# EAGLE design xmod_A (EAGLE 8.1.0)
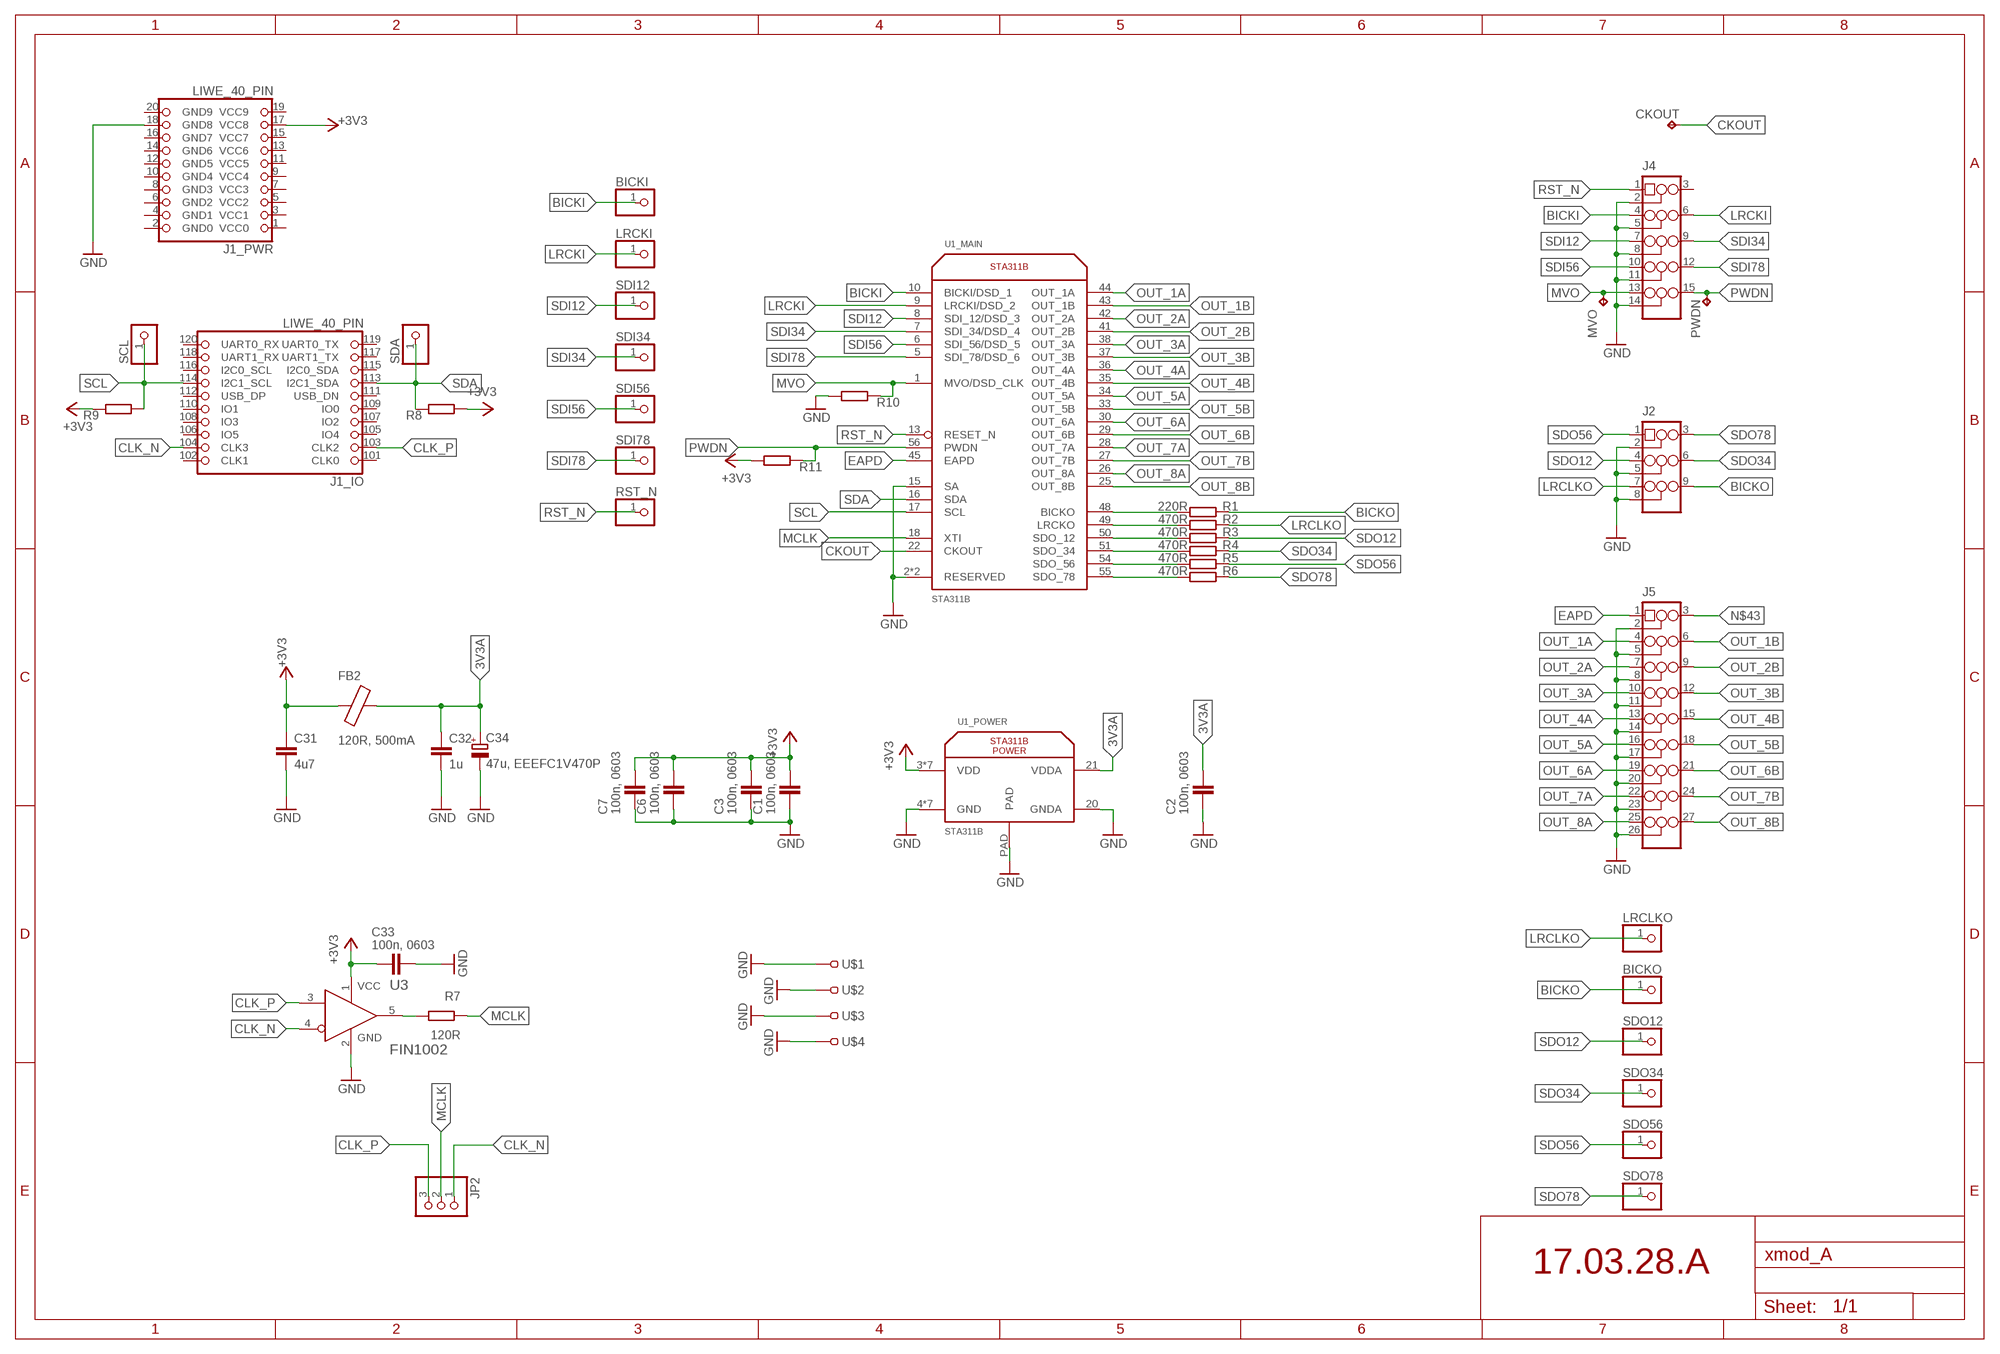
[diagram p0: schematic, sheet 1]

## Parts
BICKI  PINHD-1X1  [1X01]
BICKO  PINHD-1X1  [1X01]
C1  100n, 0603  C-EUC0603  [C0603]
C2  100n, 0603  C-EUC0603  [C0603]
C3  100n, 0603  C-EUC0603  [C0603]
C6  100n, 0603  C-EUC0603  [C0603]
C7  100n, 0603  C-EUC0603  [C0603]
C31  4u7  C-EUC0603K  [C0603K]
C32  1u  C-EUC0603K  [C0603K]
C33  100n, 0603  C-EUC0603  [C0603]
C34  47u, EEEFC1V470P  C-POL_E  [EEE-FC1V470P]
CKOUT  TPTP14R  [TP14R]
FB2  120R, 500mA  FB_0603  [L0603]
J1  LIWE_40_PIN  [LIWE_40_PIN_8X8]
J2  PINHD-3X3/90  [3X03/90]
J4  PINHD-3X5/90  [3X05/90]
J5  PINHD-3X9/90  [3X9/90]
JP2  PINHD-1X3  [1X03]
LRCKI  PINHD-1X1  [1X01]
LRCLKO  PINHD-1X1  [1X01]
MVO  TPTP14R  [TP14R]
PWDN  TPTP14R  [TP14R]
R1  220R  R-EU_R0603  [R0603]
R2  470R  R-EU_R0603  [R0603]
R3  470R  R-EU_R0603  [R0603]
R4  470R  R-EU_R0603  [R0603]
R5  470R  R-EU_R0603  [R0603]
R6  470R  R-EU_R0603  [R0603]
R7  120R  R-EU_R0603  [R0603]
R8  R-EU_R0603  [R0603]
R9  R-EU_R0603  [R0603]
R10  R-EU_R0603  [R0603]
R11  R-EU_R0603  [R0603]
RST_N  PINHD-1X1  [1X01]
SCL  PINHD-1X1  [1X01]
SDA  PINHD-1X1  [1X01]
SDI12  PINHD-1X1  [1X01]
SDI34  PINHD-1X1  [1X01]
SDI56  PINHD-1X1  [1X01]
SDI78  PINHD-1X1  [1X01]
SDO12  PINHD-1X1  [1X01]
SDO34  PINHD-1X1  [1X01]
SDO56  PINHD-1X1  [1X01]
SDO78  PINHD-1X1  [1X01]
U1  STA311B  [VFQFPN_56_8X8]
U3  FIN1002  [SOT95P280X140-5N]
U$1  TEST-22-MULTICOMP  [TEST_1MM]
U$2  TEST-22-MULTICOMP  [TEST_1MM]
U$3  TEST-22-MULTICOMP  [TEST_1MM]
U$4  TEST-22-MULTICOMP  [TEST_1MM]

## Nets
3V3A: C2.1 C32.1 C34.1(+) FB2.1 U1.21(_POWER:VDDA)
+3V3: C1.1 C3.1 C6.1 C7.1 C31.1 C33.2 FB2.2 J1.17(_PWR:VCC8) R8.1 R9.2 R11.2 U1.3(_POWER:VDD) U1.11(_POWER:VDD) U1.24(_POWER:VDD) U1.31(_POWER:VDD) U1.39(_POWER:VDD) U1.46(_POWER:VDD) U1.52(_POWER:VDD) U3.1(VCC)
BICKI: BICKI.1 J4.4 U1.10(_MAIN:BICKI/DSD_1)
BICKO: BICKO.1 J2.9 R1.2
CKOUT: CKOUT.TP U1.22(_MAIN:CKOUT)
CLK_N: J1.104(_IO:CLK3) JP2.1 U3.4(RIN-)
CLK_P: J1.103(_IO:CLK2) JP2.3 U3.3(RIN+)
EAPD: J5.1 U1.45(_MAIN:EAPD)
GND: C1.2 C2.2 C3.2 C6.2 C7.2 C31.2 C32.2 C33.1 C34.2(-) J1.18(_PWR:GND8) J2.2 J2.5 J2.8 J4.2 J4.5 J4.8 J4.11 J4.14 J5.2 J5.5 J5.8 J5.11 J5.14 J5.17 J5.20 J5.23 J5.26 R10.2 U1.2(_MAIN:RESERVED) U1.4(_POWER:GND) U1.12(_POWER:GND) U1.14(_MAIN:RESERVED) U1.15(_MAIN:SA) U1.20(_POWER:GNDA) U1.23(_POWER:GND) U1.32(_POWER:GND) U1.40(_POWER:GND) U1.47(_POWER:GND) U1.53(_POWER:GND) U1.PAD(_POWER:PAD) U3.2(GND) U$1.1 U$2.1 U$3.1 U$4.1
LRCKI: J4.6 LRCKI.1 U1.9(_MAIN:LRCKI/DSD_2)
LRCLKO: J2.7 LRCLKO.1 R2.2
MCLK: JP2.2 R7.1 U1.18(_MAIN:XTI)
MVO: J4.13 MVO.TP R10.1 U1.1(_MAIN:MVO/DSD_CLK)
N$1: R1.1 U1.48(_MAIN:BICKO)
N$2: R2.1 U1.49(_MAIN:LRCKO)
N$3: R3.1 U1.50(_MAIN:SDO_12)
N$4: R4.1 U1.51(_MAIN:SDO_34)
N$5: R5.1 U1.54(_MAIN:SDO_56)
N$6: R6.1 U1.55(_MAIN:SDO_78)
N$7: R7.2 U3.5(ROUT)
N$43: J5.3
OUT_1A: J5.4 U1.44(_MAIN:OUT_1A)
OUT_1B: J5.6 U1.43(_MAIN:OUT_1B)
OUT_2A: J5.7 U1.42(_MAIN:OUT_2A)
OUT_2B: J5.9 U1.41(_MAIN:OUT_2B)
OUT_3A: J5.10 U1.38(_MAIN:OUT_3A)
OUT_3B: J5.12 U1.37(_MAIN:OUT_3B)
OUT_4A: J5.13 U1.36(_MAIN:OUT_4A)
OUT_4B: J5.15 U1.35(_MAIN:OUT_4B)
OUT_5A: J5.16 U1.34(_MAIN:OUT_5A)
OUT_5B: J5.18 U1.33(_MAIN:OUT_5B)
OUT_6A: J5.19 U1.30(_MAIN:OUT_6A)
OUT_6B: J5.21 U1.29(_MAIN:OUT_6B)
OUT_7A: J5.22 U1.28(_MAIN:OUT_7A)
OUT_7B: J5.24 U1.27(_MAIN:OUT_7B)
OUT_8A: J5.25 U1.26(_MAIN:OUT_8A)
OUT_8B: J5.27 U1.25(_MAIN:OUT_8B)
PWDN: J4.15 PWDN.TP R11.1 U1.56(_MAIN:PWDN)
RST_N: J4.1 RST_N.1 U1.13(_MAIN:RESET_N)
SCL: J1.114(_IO:I2C1_SCL) R9.1 SCL.1 U1.17(_MAIN:SCL)
SDA: J1.113(_IO:I2C1_SDA) R8.2 SDA.1 U1.16(_MAIN:SDA)
SDI12: J4.7 SDI12.1 U1.8(_MAIN:SDI_12/DSD_3)
SDI34: J4.9 SDI34.1 U1.7(_MAIN:SDI_34/DSD_4)
SDI56: J4.10 SDI56.1 U1.6(_MAIN:SDI_56/DSD_5)
SDI78: J4.12 SDI78.1 U1.5(_MAIN:SDI_78/DSD_6)
SDO12: J2.4 R3.2 SDO12.1
SDO34: J2.6 R4.2 SDO34.1
SDO56: J2.1 R5.2 SDO56.1
SDO78: J2.3 R6.2 SDO78.1
Unconnected: J1.1(_PWR:VCC0) J1.2(_PWR:GND0) J1.3(_PWR:VCC1) J1.4(_PWR:GND1) J1.5(_PWR:VCC2) J1.6(_PWR:GND2) J1.7(_PWR:VCC3) J1.8(_PWR:GND3) J1.9(_PWR:VCC4) J1.10(_PWR:GND4) J1.11(_PWR:VCC5) J1.12(_PWR:GND5) J1.13(_PWR:VCC6) J1.14(_PWR:GND6) J1.15(_PWR:VCC7) J1.16(_PWR:GND7) J1.19(_PWR:VCC9) J1.20(_PWR:GND9) J1.101(_IO:CLK0) J1.102(_IO:CLK1) J1.105(_IO:IO4) J1.106(_IO:IO5) J1.107(_IO:IO2) J1.108(_IO:IO3) J1.109(_IO:IO0) J1.110(_IO:IO1) J1.111(_IO:USB_DN) J1.112(_IO:USB_DP) J1.115(_IO:I2C0_SDA) J1.116(_IO:I2C0_SCL) J1.117(_IO:UART1_TX) J1.118(_IO:UART1_RX) J1.119(_IO:UART0_TX) J1.120(_IO:UART0_RX) J4.3

## Notes on the sheet
- 17.03.28.A

## Library data of the parts
BICKI BICKO LRCKI LRCLKO RST_N SCL SDA SDI12 SDI34 SDI56 SDI78 SDO12 SDO34 SDO56 SDO78 = 25pinhead:PINHD-1X1: PIN HEADER
C1-C3 C6 C7 C31-C33 = rcl:C-EU: CAPACITOR, European symbol
C34 = 25cmsquare:C-POL: Panasonic Alluminium Electrolytic Capacitors / FC Series: FC Type: V http://www.farnell.com/datasheets/2059994.pdf?_ga=1.187970088.1293831445.1473845555
CKOUT MVO PWDN = testpad:TP: Test pad
FB2 = 25cmsquare:FB
J1 = 25cmsquare:LIWE_40_PIN
J2 = 25pinhead:PINHD-3X3
J4 = 25pinhead:PINHD-3X5
J5 = 25pinhead:PINHD-3X9
JP2 = 25pinhead:PINHD-1X3: PIN HEADER
R1-R11 = rcl:R-EU_: RESISTOR, European symbol
U1 = 25cmsquare:STA311B
U3 = 25cmsquare:FIN1002
U$1-U$4 = 25cmsquare:TEST-22-MULTICOMP: MULTICOMP TEST-22 TEST PIN, PCB, 1.0MM FARNELL: 1702010

## Board
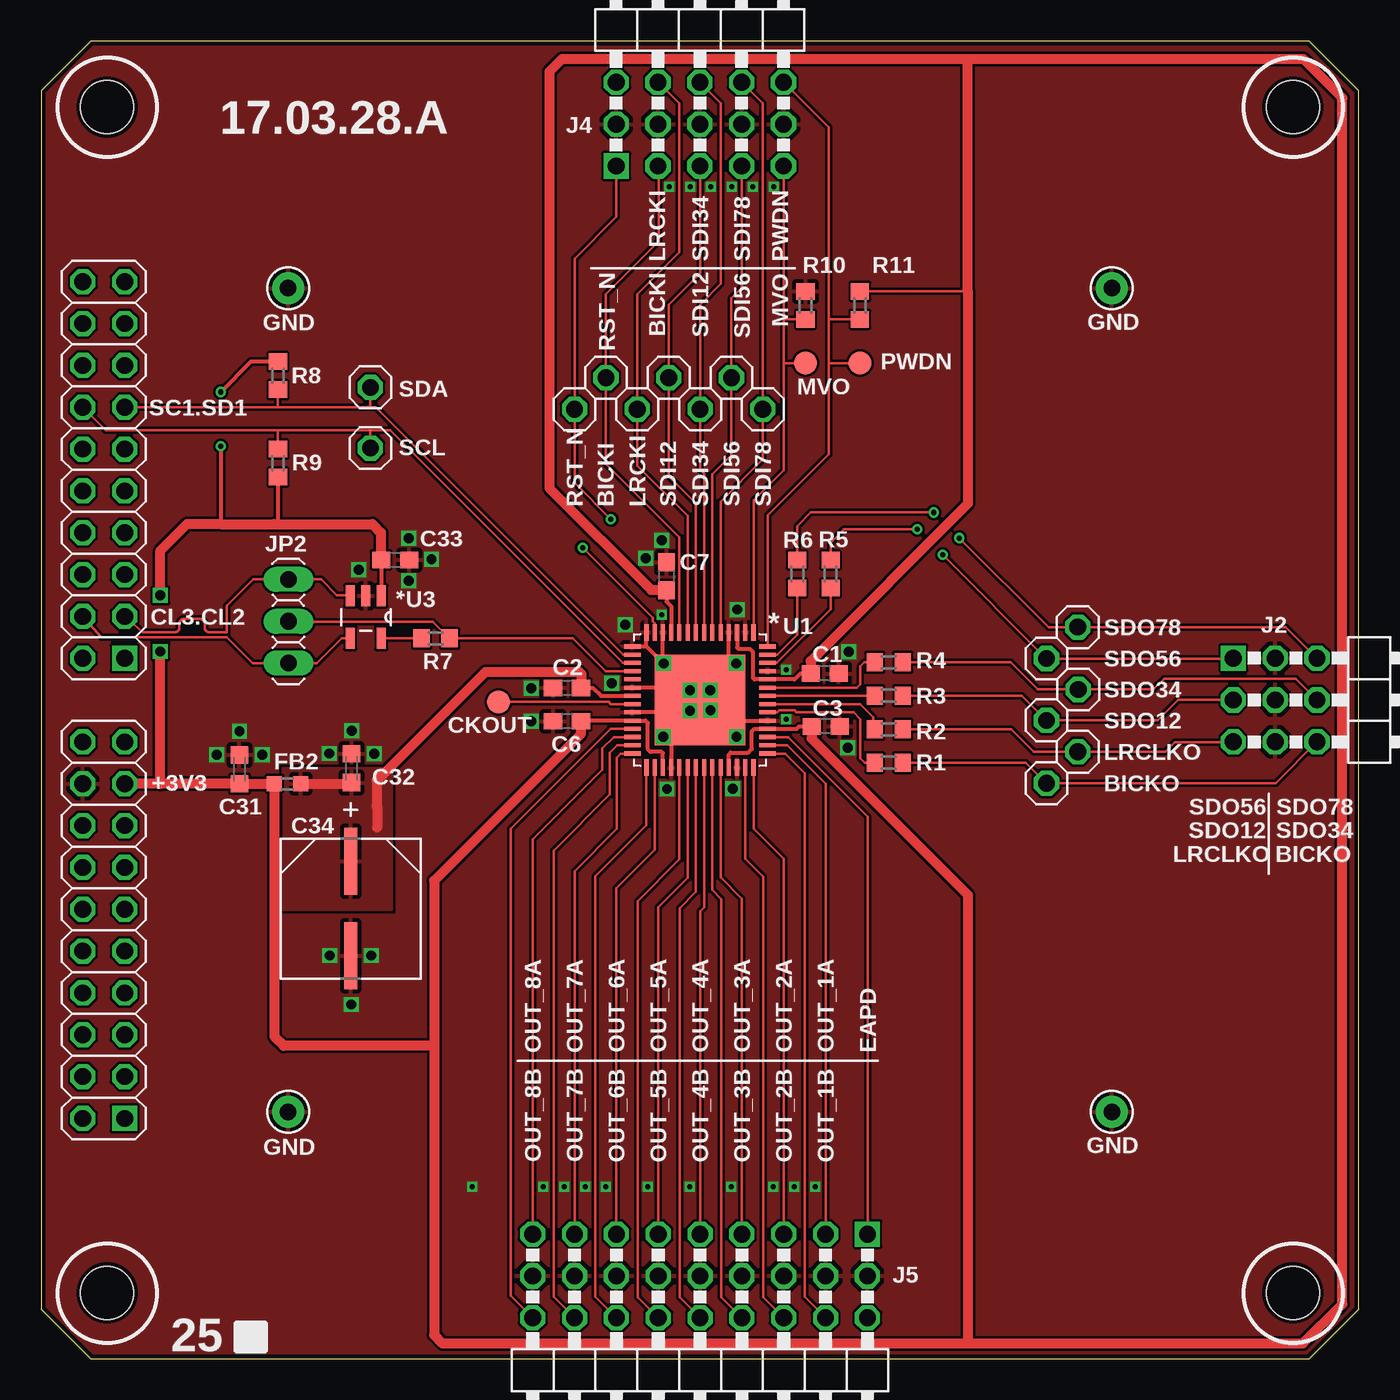
[diagram p1: board, top side]
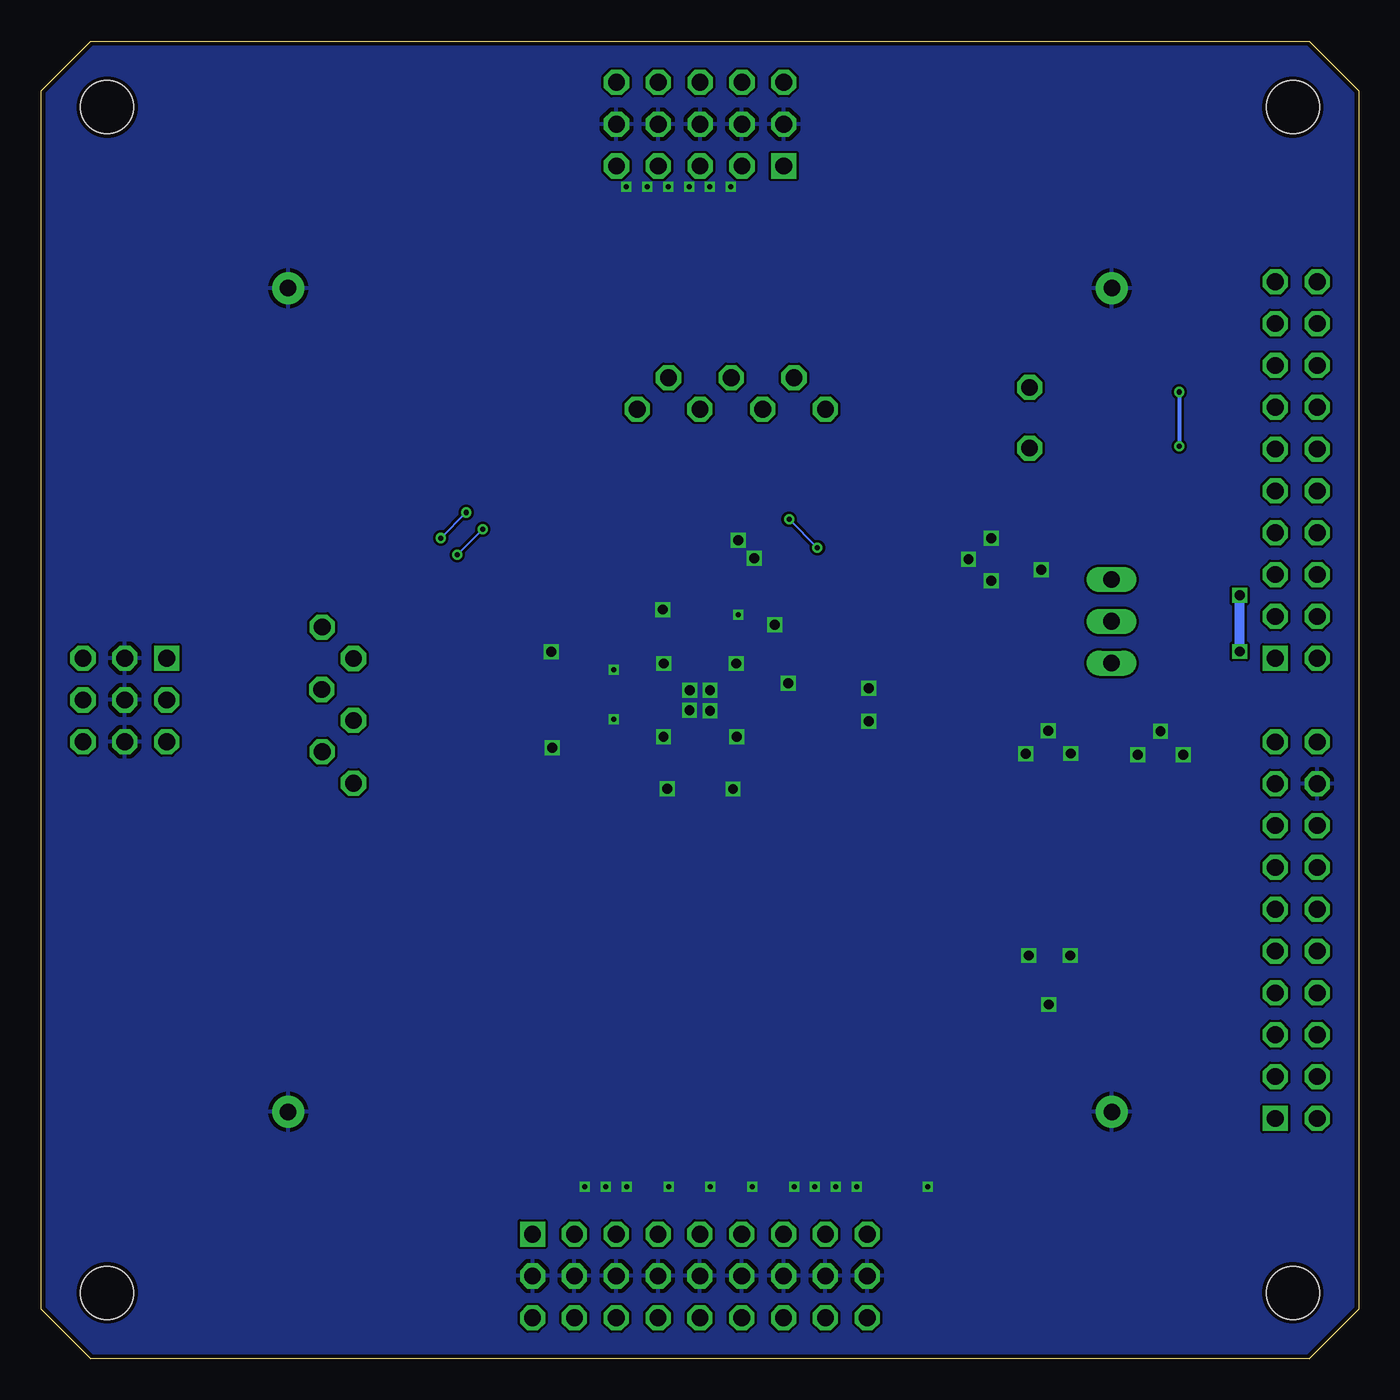
[diagram p2: board, bottom side, seen from below]

Size 80 x 80 mm. Coordinates in mm from the lower left corner, seen from the top.
Copper layers (1*16): Top 0.035mm / dielectric 1.5mm / Bottom 0.035mm
Design rules "SeeedStudio_2layer_DRU_no_angle_20140221": minimum track width 6mil, minimum drill 12mil, track to track 6mil, track to pad 6mil, pad to pad 6mil, via to via 6mil, smd to smd 0mil, copper to edge 10mil, drill to drill 10mil, minimum pad ring 10mil, minimum via ring 6mil, stop-mask expansion 2mil, vias tented up to drill 100mil, thermal gap 10mil
tRestrict: area 36.4,36.7 to 43.6,43.6

### Footprints (pad centres in the part's own frame; a part is rotated, then mirrored left to right if it is on the bottom)
1X01 = drill 1.016 octagon: 1 0,0
C0603 = smd 1.1 x 1: 1 -0.85,0; 2 0.85,0
C0603K = smd 1.05 x 1.08: 1 -0.875,0; 2 0.875,0
EEE-FC1V470P = smd 4.064 x 0.762: 1 -2.87,0; 2 2.87,0
TP14R = smd 1.4 x 1.4: TP 0,0
L0603 = smd 0.9 x 0.9: 1 -0.8,0; 2 0.8,0
LIWE_40_PIN_8X8 = drill 1.016 square: 1 74.93,65.405; 101 74.93,37.465 | drill 1.016 octagon: 2 77.47,65.405; 3 74.93,62.865; 4 77.47,62.865; 5 74.93,60.325; 6 77.47,60.325; 7 74.93,57.785; 8 77.47,57.785; 9 74.93,55.245; 10 77.47,55.245; 11 74.93,52.705; 12 77.47,52.705; 13 74.93,50.165; 14 77.47,50.165; 15 74.93,47.625; 16 77.47,47.625; 17 74.93,45.085; 18 77.47,45.085; 19 74.93,42.545; 20 77.47,42.545; 102 77.47,37.465; 103 74.93,34.925; 104 77.47,34.925; 105 74.93,32.385; 106 77.47,32.385; 107 74.93,29.845; 108 77.47,29.845; 109 74.93,27.305; 110 77.47,27.305; 111 74.93,24.765; 112 77.47,24.765; 113 74.93,22.225; 114 77.47,22.225; 115 74.93,19.685; 116 77.47,19.685; 117 74.93,17.145; 118 77.47,17.145; 119 74.93,14.605; 120 77.47,14.605 | hole 3.2: 4,76; 4,4; 76,4; 76,76
3X03/90 = drill 1.016 square: 1 -2.54,-7.62 | drill 1.016 octagon: 2 -2.54,-5.08; 3 -2.54,-2.54; 4 0,-7.62; 5 0,-5.08; 6 0,-2.54; 7 2.54,-7.62; 8 2.54,-5.08; 9 2.54,-2.54
3X05/90 = drill 1.016 square: 1 -5.08,-7.62 | drill 1.016 octagon: 2 -5.08,-5.08; 3 -5.08,-2.54; 4 -2.54,-7.62; 5 -2.54,-5.08; 6 -2.54,-2.54; 7 0,-7.62; 8 0,-5.08; 9 0,-2.54; 10 2.54,-7.62; 11 2.54,-5.08; 12 2.54,-2.54; 13 5.08,-7.62; 14 5.08,-5.08; 15 5.08,-2.54
3X9/90 = drill 1.016 square: 1 -10.16,-7.62 | drill 1.016 octagon: 2 -10.16,-5.08; 3 -10.16,-2.54; 4 -7.62,-7.62; 5 -7.62,-5.08; 6 -7.62,-2.54; 7 -5.08,-7.62; 8 -5.08,-5.08; 9 -5.08,-2.54; 10 -2.54,-7.62; 11 -2.54,-5.08; 12 -2.54,-2.54; 13 0,-7.62; 14 0,-5.08; 15 0,-2.54; 16 2.54,-7.62; 17 2.54,-5.08; 18 2.54,-2.54; 19 5.08,-7.62; 20 5.08,-5.08; 21 5.08,-2.54; 22 7.62,-7.62; 23 7.62,-5.08; 24 7.62,-2.54; 25 10.16,-7.62; 26 10.16,-5.08; 27 10.16,-2.54
1X03 = drill 1.016 long: 1 -2.54,0; 2 0,0; 3 2.54,0
R0603 = smd 1 x 1.1: 1 -0.85,0; 2 0.85,0
VFQFPN_56_8X8 = smd 0.25 x 1: 1 -3.25,-4.1; 2 -2.75,-4.1; 3 -2.25,-4.1; 4 -1.75,-4.1; 5 -1.25,-4.1; 6 -0.75,-4.1; 7 -0.25,-4.1; 8 0.25,-4.1; 9 0.75,-4.1; 10 1.25,-4.1; 11 1.75,-4.1; 12 2.25,-4.1; 13 2.75,-4.1; 14 3.25,-4.1; 29 3.25,4.1; 30 2.75,4.1; 31 2.25,4.1; 32 1.75,4.1; 33 1.25,4.1; 34 0.75,4.1; 35 0.25,4.1; 36 -0.25,4.1; 37 -0.75,4.1; 38 -1.25,4.1; 39 -1.75,4.1; 40 -2.25,4.1; 41 -2.75,4.1; 42 -3.25,4.1 | smd 1 x 0.25: 15 4.1,-3.25; 16 4.1,-2.75; 17 4.1,-2.25; 18 4.1,-1.75; 19 4.1,-1.25; 20 4.1,-0.75; 21 4.1,-0.25; 22 4.1,0.25; 23 4.1,0.75; 24 4.1,1.25; 25 4.1,1.75; 26 4.1,2.25; 27 4.1,2.75; 28 4.1,3.25; 43 -4.1,3.25; 44 -4.1,2.75; 45 -4.1,2.25; 46 -4.1,1.75; 47 -4.1,1.25; 48 -4.1,0.75; 49 -4.1,0.25; 50 -4.1,-0.25; 51 -4.1,-0.75; 52 -4.1,-1.25; 53 -4.1,-1.75; 54 -4.1,-2.25; 55 -4.1,-2.75; 56 -4.1,-3.25 | smd 5.5 x 5.5: PAD 0,0
SOT95P280X140-5N = smd 1.27 x 0.559: 1 -1.295,0.94; 2 -1.295,0; 3 -1.295,-0.94; 4 1.295,-0.94; 5 1.295,0.94
TEST_1MM = drill 1 pad 1.93: 1 0,0

### Placement (x,y rotation side)
BICKI  34.29,59.56 0 top
BICKO  61.04,34.95 0 top
C1  47.57,41.61 0 top
C2  31.93,40.74 180 top
C3  47.62,38.4 0 top
C6  31.93,38.71 180 top
C7  37.97,47.52 90 top
C31  12.04,35.79 90 top
C32  18.85,35.86 90 top
C33  21.49,48.51 180 top
C34  18.8,27.33 270 top
CKOUT  27.76,39.88 0 top
FB2  14.96,34.92 180 top
J1  80,80 180 top
J2  80,40 270 top
J4  39.99,80.04 0 top
J5  40.01,-0.05 180 top
JP2  15.01,44.78 90 top
LRCKI  36.2,57.66 0 top
LRCLKO  62.94,36.86 0 top
MVO  46.41,60.45 0 top
PWDN  49.71,60.45 0 top
R1  51.46,36.2 0 top
R2  51.46,38.23 0 top
R3  51.46,40.26 0 top
R4  51.46,42.29 0 top
R5  47.93,47.65 90 top
R6  45.9,47.65 90 top
R7  23.95,43.74 180 top
R8  14.38,59.69 270 top
R9  14.38,54.38 270 top
R10  46.41,63.96 90 top
R11  49.71,63.96 90 top
RST_N  32.38,57.66 0 top
SCL  19.99,55.3 0 top
SDA  19.99,58.98 0 top
SDI12  38.1,59.56 0 top
SDI34  40.01,57.66 0 top
SDI56  41.91,59.56 0 top
SDI78  43.81,57.66 0 top
SDO12  61.04,38.76 0 top
SDO34  62.97,40.64 0 top
SDO56  61.04,42.52 0 top
SDO78  62.94,44.42 0 top
U1  40,40 180 top
U3  19.71,45.03 270 top
U$1  15,15 0 top
U$2  65,65 0 top
U$3  15,65 0 top
U$4  65,15 0 top

### Tracks (layer width: path | path; a pad name or v marks a point on that pad's centre or on a via)
3V3A
  Top 0.152: 18.91,34.92 C32.1 | C2.1 32.49,40.8
  Top 0.254: C2.1 33.5,40.74 33.99,40.25 U1.21
  Top 0.61: FB2.1 18.91,34.92 | C2.1 32.79,40.76 32.79,41.58 32.67,41.7 26.97,41.7 20.37,35.1 20.37,33.58 20.4,33.55 20.4,32.26
  pour Top: 14.66,27.28 21.29,27.28 21.29,35.86 14.66,35.86
+3V3  (via drill 0.3, 0.6)
  Top 0.152: 12.08,34.92 C31.1 | C6.1 32.54,38.75 | 49.92,78.91 42.6,78.91 | R11.2 56.25,64.81 56.26,64.8
  Top 0.254: C1.1 46.1,41.6 45.75,41.25 U1.52 43.31,41.25 43.23,41.33 43.23,42.9 43.03,43.1 42.34,43.1 42.25,43.2 U1.3 | C3.1 46.02,38.41 45.87,38.25 U1.46 43.31,38.25 43.16,38.1 43.16,37.03 42.93,36.8 41.86,36.8 41.75,36.7 U1.39 | U1.31 | U1.31 | 32.54,38.75 U1.24 36.69,38.75 36.83,38.61 36.83,37.01 36.98,36.85 37.67,36.85 37.75,36.77 U1.31 | C7.1 37.97,45.97 38.25,45.7 U1.11 | C33.2 20.64,46.34 U3.1 | R9.2 14.38,50.9 14.15,50.67 | R8.1 12.74,60.54 v10.9,58.7 | v10.9,55.4 10.9,50.67
  Top 0.61: 7.24,34.91 J1.17 | 12.08,34.92 FB2.2 14.16,19.56 14.72,19 23.85,19 | 56.26,78.91 76.64,78.91 78.99,76.56 78.99,3.33 76.61,0.94 56.26,0.94 | 56.26,78.91 42.6,78.91 31.61,78.91 30.86,78.16 30.86,52.86 37.03,46.69 38.01,46.69 C7.1 | C3.1 46.77,37.66 56.26,28.17 56.26,0.94 | C1.1 46.71,42.37 56.26,51.92 56.26,64.8 56.26,78.91 | C6.1 32.78,37.96 23.85,29.03 23.85,19 | v7.24,46.35 7.24,49.07 8.84,50.67 10.9,50.67 14.15,50.67 20.12,50.67 20.62,50.16 20.62,48.53 C33.2 | 7.24,34.91 v7.24,42.95 | C31.1 7.24,34.91 | 23.85,19 23.85,1.45 24.36,0.94 56.26,0.94
  Bottom 0.254: v10.9,58.7 v10.9,55.4
  Bottom 0.61: v7.24,42.95 v7.24,46.35
BICKI
  Top 0.152: J4.4 37.49,72.39 37.49,67.84 34.29,64.64 BICKI.1 34.29,54.36 38.75,49.9 U1.10
BICKO
  Top 0.152: R1.2 59.79,36.2 BICKO.1 74.95,34.95 J2.9
CKOUT
  Top 0.152: 27.74,39.75 CKOUT.TP 27.78,39.89 34.45,39.89 34.6,39.75 U1.22
CLK_N
  Top 0.152: J1.104 3.64,43.81 11.28,43.81 12.85,42.24 JP2.1 16.74,42.24 18.24,43.74 U3.4
CLK_P
  Top 0.152: J1.103 6.18,44.12 8.13,44.12 arc90 8.39,44.39 8.39,44.65 arc-90 8.66,44.92 9.66,44.92 arc-90 9.93,44.65 9.93,44.39 arc90 10.19,44.12 11.28,44.12 11.28,45.72 12.88,47.32 JP2.3 16.99,47.32 17.96,46.35 18.75,46.35 U3.3
EAPD
  Top 0.152: U1.45 45.36,37.75 50.19,32.92 50.19,7.59 J5.1
GND  (via drill 0.3, 0.6)
  Top 0.254: U1.32 38.25,37.31 38.51,37.57 | U1.47 42.2,38.75 42.19,38.76 | U1.4 41.75,42.26 41.68,42.19 | 37.75,42.28 U1.12 | 37.95,42.09 37.75,42.28 | 36.75,43.26 U1.14 | 37.75,42.28 37.73,42.28 36.84,43.17 | 36.84,43.17 36.75,43.26 | U1.PAD 36.84,43.16 36.84,43.17 | U1.15 36.75,43.26 | U1.20 37.59,40.74 | U1.23 37.72,39.24
  Top 0.61: 37.72,39.24 39.24,39.24 U1.PAD | U1.PAD 37.95,42.05 37.95,42.09 | U1.PAD 39.26,40.74 37.59,40.74 | U1.PAD 41.75,41.75 41.75,42.26 | U1.PAD 38.51,38.51 38.51,37.57 | U1.PAD 41.25,38.75 42.2,38.75
  other vias: 49.02,42.93 48.97,37.11 39.4,40.59 40.61,40.59 40.64,39.37 39.4,39.34 45.24,41.83 45.24,38.84 42.27,45.49 34.65,41.02 38,34.59 41.99,34.62 37.67,45.19 36.7,48.62 29.74,40.72 29.74,38.71 17.5,36.75 20.22,36.73 13.41,36.68 10.67,36.68 17.53,24.49 20.04,24.49 18.82,21.51 19.28,47.9 22.33,49.81 23.7,48.54 38.13,71.17 39.4,71.17 40.67,71.17 41.94,71.17 43.21,71.17 26.16,10.44 30.48,10.44 31.75,10.44 33.02,10.44 34.29,10.44 36.83,10.44 39.37,10.44 41.91,10.44 44.45,10.44 45.72,10.44 46.99,10.44 44.48,71.17 37.8,42.21 42.19,42.21 42.21,37.77 37.77,37.77 35.46,44.58 22.33,47.24 37.67,49.71 12.04,38.1 18.85,38.13
  pour Bottom: -1.73,80.9 80.72,80.9 80.72,-0.53 -1.73,-0.53
  pour Top (rank 6): -2.69,81.84 -2.69,-0.97 82.25,-0.97 82.25,81.84
LRCKI
  Top 0.152: J4.6 38.73,76.22 38.73,67.18 36.2,64.64 LRCKI.1 36.2,54.23 39.25,51.17 U1.9
LRCLKO
  Top 0.152: J2.7 72.36,37.44 68.83,37.44 68.25,36.85 LRCLKO.1 60.27,36.85 58.9,38.23 R2.2
MCLK
  Top 0.152: U1.18 34.27,41.75 32.28,43.74 R7.1 23.79,44.76 15.01,44.76 JP2.2
MVO
  Top 0.152: U1.1 43.25,52.14 45.07,53.96 45.07,60.43 | 45.07,60.43 45.07,63.09 | 45.07,63.09 J4.13 | R10.1 45.09,63.11 45.07,63.09 | MVO.TP 45.1,60.45 45.07,60.43
N$1
  Top 0.152: U1.48 44.69,39.25 44.81,39.37 45.74,39.37 45.86,39.25 49.32,39.25 49.73,38.84 49.73,36.48 50.01,36.2 R1.1
N$2
  Top 0.152: R2.1 50.52,38.23 50.52,38.96 49.73,39.75 U1.49
N$3
  Top 0.152: U1.50 R3.1
N$4
  Top 0.152: U1.51 49.51,40.75 49.73,40.97 49.73,42.06 49.96,42.29 R4.1
N$5
  Top 0.152: U1.54 44.66,42.25 47.93,45.52 R5.1
N$6
  Top 0.152: U1.55 44.68,42.75 45.9,43.97 R6.1
N$7
  Top 0.152: R7.2 U3.5
OUT_1A
  Top 0.152: U1.44 45.3,37.25 47.62,34.92 J5.4
OUT_1B
  Top 0.152: U1.43 45.16,36.75 46.35,35.56 46.35,3.76 J5.6
OUT_2A
  Top 0.152: U1.42 43.25,32.19 45.09,30.35 J5.7
OUT_2B
  Top 0.152: U1.41 42.75,30.35 43.84,29.26 43.84,3.73 J5.9
OUT_3A
  Top 0.152: U1.38 41.25,29.23 42.55,27.94 J5.10
OUT_3B
  Top 0.152: U1.37 40.75,28.46 41.3,27.91 41.3,3.73 J5.12
OUT_4A
  Top 0.152: U1.36 40.25,27.42 40.01,27.18 J5.13
OUT_4B
  Top 0.152: U1.35 39.75,28.34 38.76,27.36 38.76,3.73 J5.15
OUT_5A
  Top 0.152: U1.34 39.25,29.22 37.47,27.43 J5.16
OUT_5B
  Top 0.152: U1.33 38.75,30.32 36.22,27.79 36.22,3.73 J5.18
OUT_6A
  Top 0.152: U1.30 37.25,30.9 34.92,28.57 J5.19
OUT_6B
  Top 0.152: U1.29 36.75,32.41 33.66,29.31 33.66,3.76 J5.21
OUT_7A
  Top 0.152: U1.28 35.2,36.75 34.95,36.5 34.95,32.18 32.38,29.62 J5.22
OUT_7B
  Top 0.152: U1.27 34.96,37.25 34.52,36.8 34.52,34.27 31.11,30.86 31.11,3.76 J5.24
OUT_8A
  Top 0.152: U1.26 34.75,37.75 34.06,37.06 34.06,35.76 29.84,31.55 J5.25
OUT_8B
  Top 0.152: U1.25 34.57,38.25 28.5,32.18 28.5,3.83 J5.27
PWDN
  Top 0.152: U1.56 44.1,51.21 47.8,54.91 47.8,60.43 | 47.8,60.43 47.8,63.09 | 47.8,63.09 47.8,74.77 J4.15 | R11.1 47.82,63.11 47.8,63.09 | PWDN.TP 47.83,60.45 47.8,60.43
RST_N  (via drill 0.3)
  Top 0.152: U1.13 37.25,44.67 37.13,44.79 37.13,44.98 v32.87,49.25 | J4.1 34.91,69.33 32.38,66.8 RST_N.1 32.38,53.19 v34.59,50.98
  Bottom 0.152: v34.59,50.98 v32.87,49.25
SCL
  Top 0.152: U1.17 35.32,42.25 21.18,56.39 19.99,56.39 | SCL.1 19.99,56.39 | J1.114 3.92,56.39 14.38,56.39 | 14.38,56.39 19.99,56.39 | R9.1 14.38,56.39
SDA
  Top 0.152: U1.16 35.33,42.75 20.3,57.77 19.99,57.77 | 14.35,57.77 19.99,57.77 | 14.35,57.77 J1.113 | SDA.1 19.99,57.77 | R8.2 14.38,57.8 14.35,57.77
SDI12
  Top 0.152: J4.7 40.01,72.41 40.01,65.91 38.1,64.01 SDI12.1 38.1,53.59 39.75,51.94 U1.8
SDI34
  Top 0.152: J4.9 41.27,76.22 41.27,65.28 40.01,64.01 SDI34.1 40.01,53.98 40.25,53.73 U1.7
SDI56
  Top 0.152: J4.10 42.55,72.41 42.55,65.02 41.91,64.39 SDI56.1 41.91,54.86 40.75,53.7 U1.6
SDI78
  Top 0.152: J4.12 43.81,76.22 SDI78.1 43.81,54.61 41.25,52.05 U1.5
SDO12
  Top 0.152: 72.35,40.03 J2.4 69.04,40.01 67.79,38.76 SDO12.1 59.54,40.26 R3.2
SDO34
  Top 0.152: J2.6 76.16,41.3 68.17,41.3 67.51,40.64 SDO34.1 60.5,40.64 58.85,42.29 R4.2
SDO56  (via drill 0.3)
  Top 0.152: R5.2 47.93,49.55 48.74,50.37 v53.19,50.37 | v54.74,48.82 SDO56.1 72.36,42.52 J2.1
  Bottom 0.152: v54.74,48.82 v53.19,50.37
SDO78  (via drill 0.3)
  Top 0.152: R6.2 45.9,50.55 46.74,51.38 v54.2,51.38 | v55.75,49.84 61.16,44.42 SDO78.1 75.58,44.42 J2.3
  Bottom 0.152: v55.75,49.84 v54.2,51.38

### Text on the board
tPlace: SC1.SD1 | CL3.CL2
tNames: 17.03.28.A | LRCKI | SDI34 | SDI78 | PWDN | RST_N | BICKI | SDI12 | SDI56 | MVO | GND | GND | +3V3 | SDO56 | SDO78 | SDO12 | SDO34 | LRCLKO | BICKO | OUT_8A | OUT_7A | OUT_6A | OUT_5A | OUT_4A | OUT_3A | OUT_2A | OUT_1A | EAPD | OUT_8B | OUT_7B | OUT_6B | OUT_5B | OUT_4B | OUT_3B | OUT_2B | OUT_1B | GND | GND | 25